# Altium project Pulser.PrjPcb
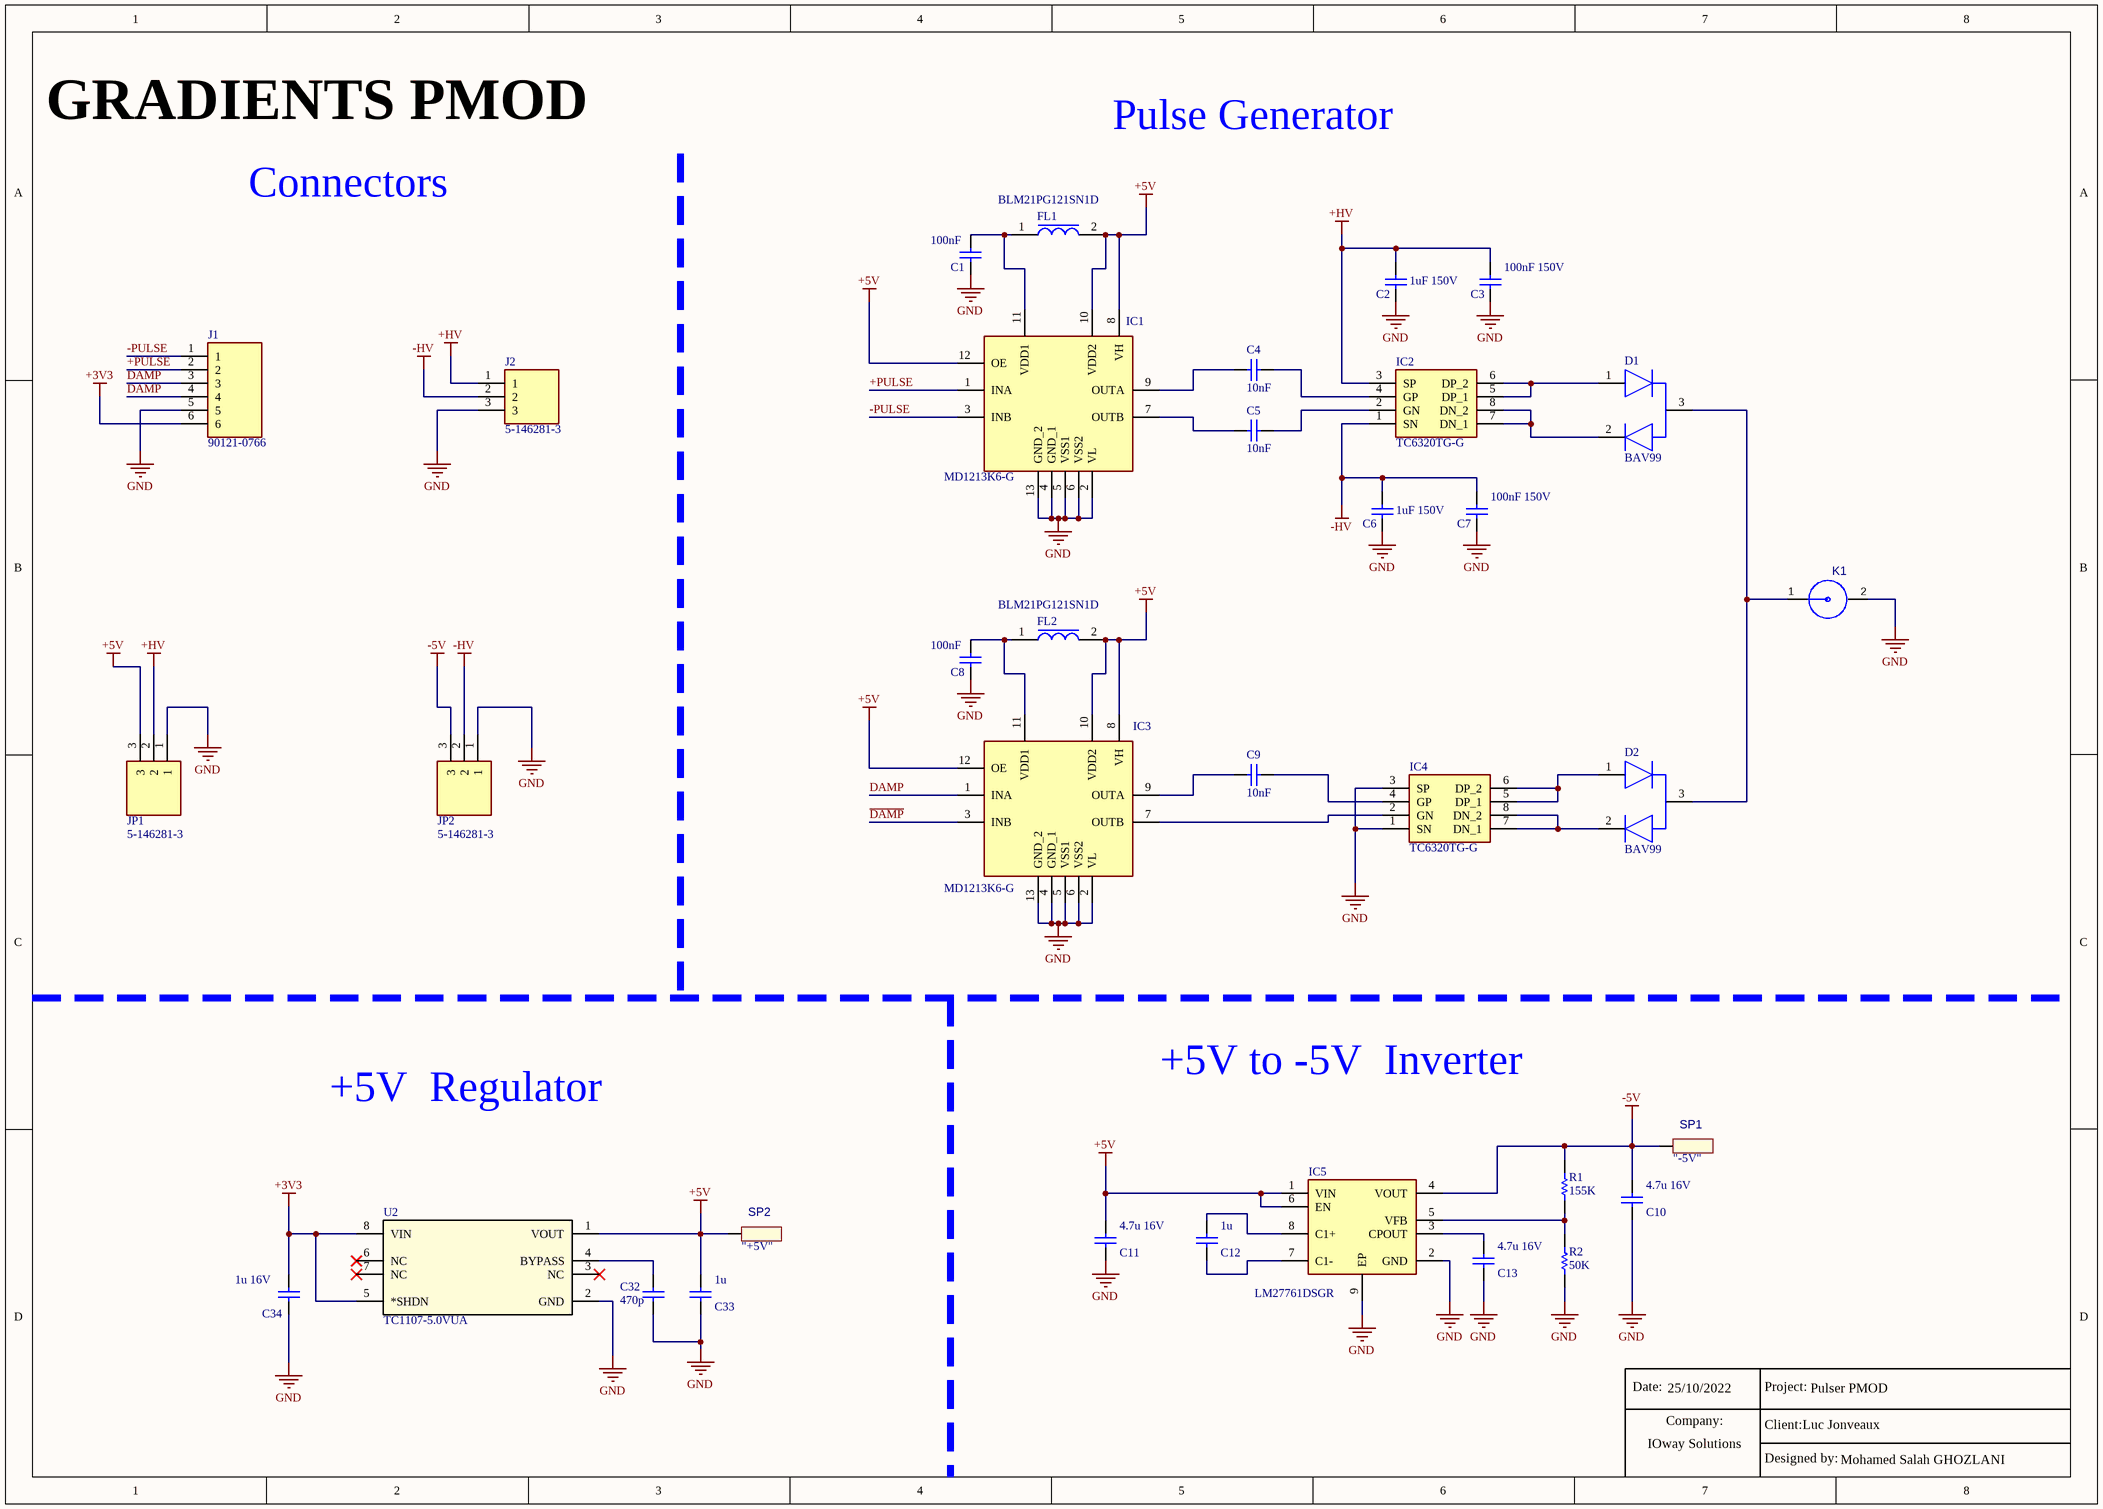
[diagram p0: Pulser.SchDoc]
1 sheet, 35 parts. Net scope: global (net labels, ports and power ports of the same name join across sheets).
Board file: Pulser.PcbDoc

## Sheet Pulser.SchDoc
size A3

### Parts
C1  value 100nF  [SM0603 _3D_cap]  (hidden comment: cap0603)
C2  value 1uF 150V  [C1206]  (hidden comment: cap0603)
C3  value 100nF 150V  [C0805]  (hidden comment: cap0603)
C4  value 10nF  [SM0603 _3D_cap]  (hidden comment: cap0603)
C5  value 10nF  [SM0603 _3D_cap]  (hidden comment: cap0603)
C6  value 1uF 150V  [C1206]  (hidden comment: cap0603)
C7  value 100nF 150V  [C0805]  (hidden comment: cap0603)
C8  value 100nF  [SM0603 _3D_cap]  (hidden comment: cap0603)
C9  value 10nF  [SM0603 _3D_cap]  (hidden comment: cap0603)
C10  value 4.7u 16V  [SM0603 _3D_cap]  (hidden comment: cap0603)
C11  value 4.7u 16V  [SM0603 _3D_cap]  (hidden comment: cap0603)
C12  value 1u  [SM0603 _3D_cap]  (hidden comment: cap0603)
C13  value 4.7u 16V  [SM0603 _3D_cap]  (hidden comment: cap0603)
C32  value 470p  [0402_C]  (hidden comment: cap0402)
C33  value 1u  [SM0603 _3D_cap]  (hidden comment: cap0603)
C34  value 1u 16V  [SM0603 _3D_cap]  (hidden comment: cap0603)
D1  BAV99  [BAV99215]
D2  BAV99  [BAV99215]
FL1  BLM21PG121SN1D  [BLM21AG102BH1J]
FL2  BLM21PG121SN1D  [BLM21AG102BH1J]
IC1  MD1213K6-G  [QFN80P400X400X100-13N-D]
IC2  TC6320TG-G  [SOIC127P600X175-8N]
IC3  MD1213K6-G  [QFN80P400X400X100-13N-D]
IC4  TC6320TG-G  [SOIC127P600X175-8N]
IC5  LM27761DSGR  [SON50P200X200X80-9N]
J1  90121-0766  [901210766]
J2  5-146281-3  [HDRV3W96P0X254_1X3_721X234X869P]
JP1  5-146281-3  [HDRV3W96P0X254_1X3_721X234X869P]
JP2  5-146281-3  [HDRV3W96P0X254_1X3_721X234X869P]
K1  SMA_Edge  [AMPHENOL_132357-11]  (value not drawn)
R1  155K  [1608[0603]]
R2  50K  [1608[0603]]
SP1  value "-5V"  [SolderPad_D1mm _round]  (hidden comment: SolderPad D1mm_round)
SP2  value "+5V"  [SolderPad_D1mm _round]  (hidden comment: SolderPad D1mm_round)
U2  TC1107-5.0VUA  [MSOP8_MC_MCH_]

### Nets
+3V3: C34.1 J1.6 U2.5(*SHDN) U2.8(VIN)
+5V: C11.1 C33.1 FL1.2 FL2.2 IC1.8(VH) IC1.10(VDD2) IC1.12(OE) IC3.8(VH) IC3.10(VDD2) IC3.12(OE) IC5.1(VIN) IC5.6(EN) JP1.3 SP2.1 U2.1(VOUT)
+HV: C2.1 C3.1 IC2.3(SP) J2.1 JP1.2
-5V: C10.1 IC5.4(VOUT) JP2.3 R1.2 SP1.1
-HV: C6.1 C7.1 IC2.1(SN) J2.2 JP2.2
GND: C1.2 C2.2 C3.2 C6.2 C7.2 C8.2 C10.2 C11.2 C13.2 C32.1 C33.2 C34.2 IC1.2(VL) IC1.4(GND_1) IC1.5(VSS1) IC1.6(VSS2) IC1.13(GND_2) IC3.2(VL) IC3.4(GND_1) IC3.5(VSS1) IC3.6(VSS2) IC3.13(GND_2) IC4.1(SN) IC4.3(SP) IC5.2(GND) IC5.9(EP) J1.5 J2.3 JP1.1 JP2.1 K1.2 R2.1 U2.2(GND)
+PULSE: IC1.1(INA) J1.2
-PULSE: IC1.3(INB) J1.1
~{DAMP}: IC3.3(INB) J1.3
DAMP: IC3.1(INA) J1.4
NetC1_1: C1.1 FL1.1 IC1.11(VDD1)
NetC4_1: C4.1 IC1.9(OUTA)
NetC4_2: C4.2 IC2.4(GP)
NetC5_1: C5.1 IC1.7(OUTB)
NetC5_2: C5.2 IC2.2(GN)
NetC8_1: C8.1 FL2.1 IC3.11(VDD1)
NetC9_1: C9.1 IC3.9(OUTA)
NetC9_2: C9.2 IC4.4(GP)
NetC12_1: C12.1 IC5.8(C1+)
NetC12_2: C12.2 IC5.7(C1-)
NetC13_1: C13.1 IC5.3(CPOUT)
NetC32_2: C32.2 U2.4(BYPASS)
NetD1_1: D1.1(B) IC2.5(DP_1) IC2.6(DP_2)
NetD1_2: D1.2(E) IC2.7(DN_1) IC2.8(DN_2)
NetD1_3: D1.3(C) D2.3(C) K1.1
NetD2_1: D2.1(B) IC4.5(DP_1) IC4.6(DP_2)
NetD2_2: D2.2(E) IC4.7(DN_1) IC4.8(DN_2)
NetIC3_7: IC3.7(OUTB) IC4.2(GN)
NetIC5_5: IC5.5(VFB) R1.1 R2.2

Not connected (* = marked no-connect by the designer): U2 3(NC)* 6(NC)* 7(NC)*

### Notes on the sheet
- GRADIENTS PMOD
- Pulse Generator
- Connectors
- +5V  Regulator
- +5V to -5V  Inverter
- Date:
- 25/10/2022
- Project:
- Pulser PMOD
- IOway Solutions
- Company:
- Designed by:
- Client:
- Luc Jonveaux
- Mohamed Salah GHOZLANI

### Library data of the parts
C1-C13 C33 C34 = cap0603: Capacitor  0603 inch; Published: 8-Jun-2000; LatestRevisionDate: 17-Jul-2002; LatestRevisionNote: Re-released for DXP Platform.; PackageReference: RAD-0.3; Publisher: Altium Limited; PackageDescription: Radial Cap, Thru-Hole; 2 Leads; 0.3 in Pin Spacing
C32 = cap0603: Capacitor  0402 inch; Published: 8-Jun-2000; LatestRevisionDate: 17-Jul-2002; LatestRevisionNote: Re-released for DXP Platform.; PackageReference: RAD-0.3; Publisher: Altium Limited; PackageDescription: Radial Cap, Thru-Hole; 2 Leads; 0.3 in Pin Spacing
D1 D2 = BAV99,215: Diode; Manufacturer_Name: Nexperia; Datasheet Link: https://assets.nexperia.com/documents/data-sheet/BAV99_SER.pdf; Height: 1.1mm; Manufacturer_Part_Number: BAV99,215; Mouser Part Number: 771-BAV99-T/R; Mouser Price/Stock: https://www.mouser.co.uk/ProductDetail/Nexperia/BAV99215?qs=me8TqzrmIYWbN0bCKV3n5w%3D%3D; Arrow Part Number: BAV99,215; Arrow Price/Stock: https://www.arrow.com/en/products/bav99215/nexperia?region=nac
FL1 FL2 = BLM21PG121SN1D: Filter; Manufacturer_Name: Murata Electronics; Datasheet Link: https://www.murata.com/en-us/products/productdetail?partno=BLM21PG121SN1%23; Height: 1.05mm; Manufacturer_Part_Number: BLM21PG121SN1D; Mouser Part Number: 81-BLM21PG121SN1D; Mouser Price/Stock: https://www.mouser.co.uk/ProductDetail/Murata-Electronics/BLM21PG121SN1D?qs=MY6wChARw2zaR3kESBLGTQ%3D%3D; Arrow Part Number: BLM21PG121SN1D; Arrow Price/Stock: https://www.arrow.com/en/products/blm21pg121sn1d/murata-manufacturing?region=nac
IC1 IC3 = MD1213K6-G: Integrated Circuit; Manufacturer_Name: Microchip; Datasheet Link: http://www.microchip.com/mymicrochip/filehandler.aspx?ddocname=en570148; Height: 1mm; Manufacturer_Part_Number: MD1213K6-G; Mouser Part Number: 689-MD1213K6-G; Mouser Price/Stock: https://www.mouser.co.uk/ProductDetail/Microchip-Technology/MD1213K6-G?qs=yzbL9BrvDmMQeiy2ctoE9A%3D%3D; Arrow Part Number: MD1213K6-G; Arrow Price/Stock: https://www.arrow.com/en/products/md1213k6-g/microchip-technology
IC2 IC4 = TC6320TG-G: Integrated Circuit; Manufacturer_Name: Microchip; Datasheet Link: https://ww1.microchip.com/downloads/en/DeviceDoc/20005697A.pdf; Height: 1.75mm; Manufacturer_Part_Number: TC6320TG-G; Mouser Part Number: 689-TC6320TG-G; Mouser Price/Stock: https://www.mouser.co.uk/ProductDetail/Microchip-Technology/TC6320TG-G?qs=%252BgoAgGjL%252Bh4K5qliaxT5nQ%3D%3D; Arrow Part Number: TC6320TG-G; Arrow Price/Stock: https://www.arrow.com/en/products/tc6320tg-g/microchip-technology?region=nac
IC5 = LM27761DSGR: Integrated Circuit; Manufacturer_Name: Texas Instruments; Datasheet Link: http://www.ti.com/lit/gpn/lm27761; Height: 0.8mm; Manufacturer_Part_Number: LM27761DSGR; Mouser Part Number: 595-LM27761DSGR; Mouser Price/Stock: https://www.mouser.co.uk/ProductDetail/Texas-Instruments/LM27761DSGR?qs=jK8VN%252BJp1h5rfPCO21nS4g%3D%3D; Arrow Part Number: LM27761DSGR; Arrow Price/Stock: https://www.arrow.com/en/products/lm27761dsgr/texas-instruments?region=nac
J1 = 90121-0766: Connector; Manufacturer_Name: Molex; Datasheet Link: http://www.molex.com/webdocs/datasheets/pdf/en-us/0901210766_PCB_HEADERS.pdf; Height: 4mm; Manufacturer_Part_Number: 90121-0766; Mouser Part Number: 538-90121-0766; Mouser Price/Stock: https://www.mouser.co.uk/ProductDetail/Molex/90121-0766?qs=PvP5v7EimslgD6hQyHQ2Ag%3D%3D
J2 JP1 JP2 = 5-146281-3: Connector; Manufacturer_Name: TE Connectivity; Datasheet Link: http://www.te.com/commerce/DocumentDelivery/DDEController?Action=showdoc&DocId=Customer+Drawing%7F146281%7FG2%7Fpdf%7FEnglish%7FENG_CD_146281_G2.pdf%7F5-146281-3; Height: 8.69mm; Manufacturer_Part_Number: 5-146281-3; Mouser Part Number: 571-5-146281-3; Mouser Price/Stock: https://www.mouser.co.uk/ProductDetail/TE-Connectivity/5-146281-3?qs=bwpFY26eRVc0RlLXOkMSNw%3D%3D; Arrow Part Number: 5-146281-3; Arrow Price/Stock: https://www.arrow.com/en/products/5-146281-3/te-connectivity
R1 R2 = Res1: Resistor; Value: 1K; Published: 8-Jun-2000; LatestRevisionDate: 17-Jul-2002; LatestRevisionNote: Re-released for DXP Platform.; PackageReference: AXIAL-0.3; Publisher: Altium Limited; PackageDescription: Axial Device, Thru-Hole; 2 Leads; 0.3 in Pin Spacing
SP1 SP2 = SolderPad D1mm_round: for finger touch
U2 = TC1107-5.0VUA: No Description Available; Mfr_Name: Microchip; Copyright: Copyright (C) 2022 Ultra Librarian. All rights reserved.; Manufacturer_Part_Number: TC1107-5.0VUA; RefDes: RefDes; Type: DEV
K1 = SMA_Edge: Value: *